# EAGLE design untitled (EAGLE 9.6.2)
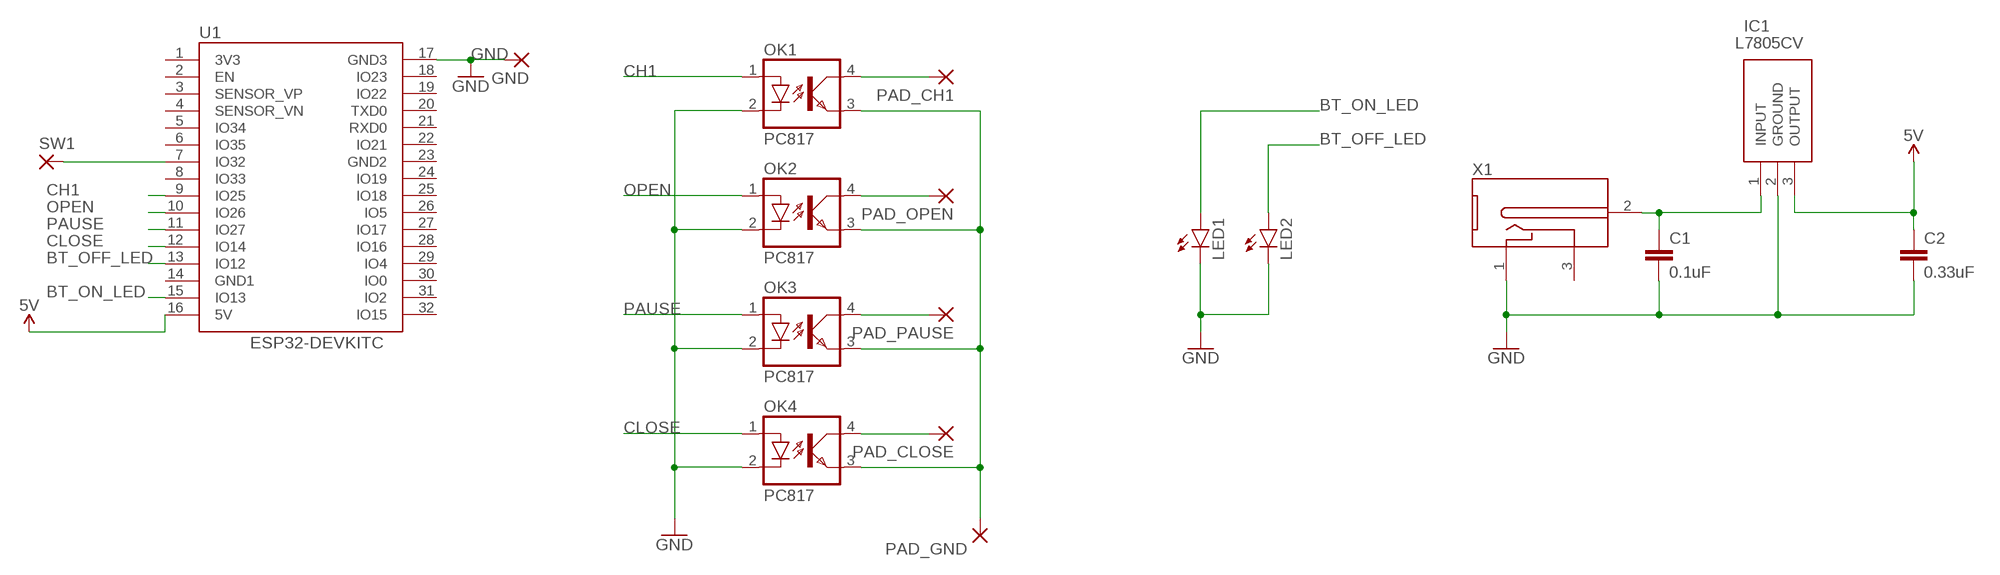
[diagram p0: schematic, sheet 1]

## Parts
C1  0.1uF  C2.5/2  [C2.5-2]
C2  0.33uF  C2.5/2  [C2.5-2]
GND  2,54/1,0  [2,54/1,0]
IC1  L7805CV  [TO255P460X1020X2008-3P]
LED1  LED5MM  [LED5MM]
LED2  LED5MM  [LED5MM]
OK1  PC817  [DIL04]
OK2  PC817  [DIL04]
OK3  PC817  [DIL04]
OK4  PC817  [DIL04]
PAD_CH1  2,54/1,0  [2,54/1,0]
PAD_CLOSE  2,54/1,0  [2,54/1,0]
PAD_GND  2,54/1,0  [2,54/1,0]
PAD_OPEN  2,54/1,0  [2,54/1,0]
PAD_PAUSE  2,54/1,0  [2,54/1,0]
SW1  2,54/1,0  [2,54/1,0]
U1  ESP32-DEVKITC  [MODULE_ESP32-DEVKITC]
X1  DC-2.1MM-5MM  [DC-21MM]

## Nets
5V: C2.1 IC1.3(OUTPUT) U1.16(5V)
BT_OFF_LED: LED2.A U1.13(IO12)
BT_ON_LED: LED1.A U1.15(IO13)
CH1: OK1.1(A) U1.9(IO25)
CLOSE: OK4.1(A) U1.12(IO14)
GND: C1.2 C2.2 GND.1(P) IC1.2(GROUND) LED1.K(C) LED2.K(C) OK1.2(C) OK2.2(C) OK3.2(C) OK4.2(C) U1.17(GND3) X1.1
N$1: OK1.3(EMIT) OK2.3(EMIT) OK3.3(EMIT) OK4.3(EMIT) PAD_GND.1(P)
N$2: OK2.4(COL) PAD_OPEN.1(P)
N$3: OK1.4(COL) PAD_CH1.1(P)
N$4: OK3.4(COL) PAD_PAUSE.1(P)
N$5: OK4.4(COL) PAD_CLOSE.1(P)
N$6: SW1.1(P) U1.7(IO32)
N$8: C1.1 IC1.1(INPUT) X1.2
OPEN: OK2.1(A) U1.10(IO26)
PAUSE: OK3.1(A) U1.11(IO27)
Unconnected: U1.2(EN) U1.3(SENSOR_VP) U1.4(SENSOR_VN) U1.5(IO34) U1.6(IO35) U1.8(IO33) U1.18(IO23) U1.19(IO22) U1.20(TXD0) U1.21(RXD0) U1.22(IO21) U1.24(IO19) U1.25(IO18) U1.26(IO5) U1.27(IO17) U1.28(IO16) U1.29(IO4) U1.30(IO0) U1.31(IO2) U1.32(IO15)

## Power pins joined to a net without a drawn wire
2: X1.3
3V3: U1.1(3V3)
GND1: U1.14(GND1)
GND2: U1.23(GND2)

## Library data of the parts
C1 C2 = capacitor-wima:C: CAPACITOR naming: grid - package width
GND PAD_CH1 PAD_CLOSE PAD_GND PAD_OPEN PAD_PAUSE SW1 = wirepad:2,54/1,0: THROUGH-HOLE PAD
IC1 = L7805CV:L7805CV: Linear voltage regulator,L7805CV 5V 1.5A STMicroelectronics L7805CV, Single Linear Voltage Regulator, 1.5A 5 V, 3-Pin TO-220 Source: Datasheet <http://www.st.com/web/en/resource/technical/document/datasheet/CD00000444.pdf>; ARROW_PART_NUMBER: L7805CV; ARROW_PRICE-STOCK: https://www.arrow.com/en/products/l7805cv/stmicroelectronics?region=europe; DESCRIPTION: Linear voltage regulator,L7805CV 5V 1.5A STMicroelectronics L7805CV, Single Linear Voltage Regulator, 1.5A 5 V, 3-Pin TO-220; HEIGHT: 4.6mm; MANUFACTURER_NAME: STMicroelectronics; MANUFACTURER_PART_NUMBER: L7805CV; MOUSER_PART_NUMBER: 511-L7805CV; MOUSER_PRICE-STOCK: https://www.mouser.co.uk/ProductDetail/STMicroelectronics/L7805CV?qs=9NrABl3fj%2FqplZAHiYUxWg%3D%3D
LED1 LED2 = led:LED: LED OSRAM: - CHIPLED LG R971, LG N971, LY N971, LG Q971, LY Q971, LO R971, LY R971 LH N974, LH R974 LS Q976, LO Q976, LY Q976 LO Q996 - Hyper CHIPLED LW Q18S LB Q993, LB Q99A, LB R99A - SideLED LS A670, LO A670, LY A670, LG A670, LP A670 LB A673, LV A673, LT A673, LW A673 LH A674 LY A675 LS A676, LA A676, LO A676, LY A676, LW A676 LS A679, LY A679, LG A679 - Hyper Micro SIDELED® LS Y876, LA Y876, LO Y876, LY Y876 LT Y87S - SmartLED LW L88C, LW L88S LB L89C, LB L89S, LG L890 LS L89K, LO L89K, LY L89K LS L896, LA L896, LO L896, LY L896 - TOPLED LS T670, LO T670, LY T670, LG T670, LP T670 LSG T670, LSP T670, LSY T670, LOP T670, LYG T670 LG T671, LOG T671, LSG T671 LB T673, LV T673, LT T673, LW T673 LH T674 LS T676, LA T676, LO T676, LY T676, LB T676, LH T676, LSB T676, LW T676 LB T67C, LV T67C, LT T67C, LS T67K, LO T67K, LY T67K, LW E67C LS E67B, LA E67B, LO E67B, LY E67B, LB E67C, LV E67C, LT E67C LW T67C LS T679, LY T679, LG T679 LS T770, LO T770, LY T770, LG T770, LP T770 LB T773, LV T773, LT T773, LW T773 LH T774 LS E675, LA E675, LY E675, LS T675 LS T776, LA T776, LO T776, LY T776, LB T776 LHGB T686 LT T68C, LB T68C - Hyper Mini TOPLED® LB M676 - Mini TOPLED Santana® LG M470 LS M47K, LO M47K, LY M47K Source: http://www.osram.convergy.de LUXEON: - LUMILED® LXK2-PW12-R00, LXK2-PW12-S00, LXK2-PW14-U00, LXK2-PW14-V00 LXK2-PM12-R00, LXK2-PM12-S00, LXK2-PM14-U00 LXK2-PE12-Q00, LXK2-PE12-R00, LXK2-PE12-S00, LXK2-PE14-T00, LXK2-PE14-U00 LXK2-PB12-K00, LXK2-PB12-L00, LXK2-PB12-M00, LXK2-PB14-N00, LXK2-PB14-P00, LXK2-PB14-Q00 LXK2-PR12-L00, LXK2-PR12-M00, LXK2-PR14-Q00, LXK2-PR14-R00 LXK2-PD12-Q00, LXK2-PD12-R00, LXK2-PD12-S00 LXK2-PH12-R00, LXK2-PH12-S00 LXK2-PL12-P00, LXK2-PL12-Q00, LXK2-PL12-R00 Source: www.luxeon.com KINGBRIGHT: KA-3528ASYC Source: www.kingbright.com
OK1-OK4 = optocoupler:PC817: SHARP OPTO COUPLER; MPN: PC817X4J000F; OC_FARNELL: 9707727; OC_NEWARK: 97K7059
U1 = AE-ESP32-WROOM-32E-MINI:ESP32-DEVKITC: ESP32-DEVKITC Check availability <https://pricing.snapeda.com/parts/ESP32-DEVKITC/Espressif%20Systems/view-part?ref=eda>; AVAILABILITY: In Stock; DESCRIPTION: ESP32-WROOM-32UE series Transceiver; 802.11 b/g/n (Wi-Fi, WiFi, WLAN), Bluetooth ® Smart Ready 4.x Dual Mode Evaluation Board; MF: Espressif Systems; MP: ESP32-DEVKITC; PACKAGE: None; PRICE: None; PURCHASE-URL: https://pricing.snapeda.com/search/part/ESP32-DEVKITC/?ref=eda
X1 = power-jack:DC: 5mm x 2.1mm jack

## Board
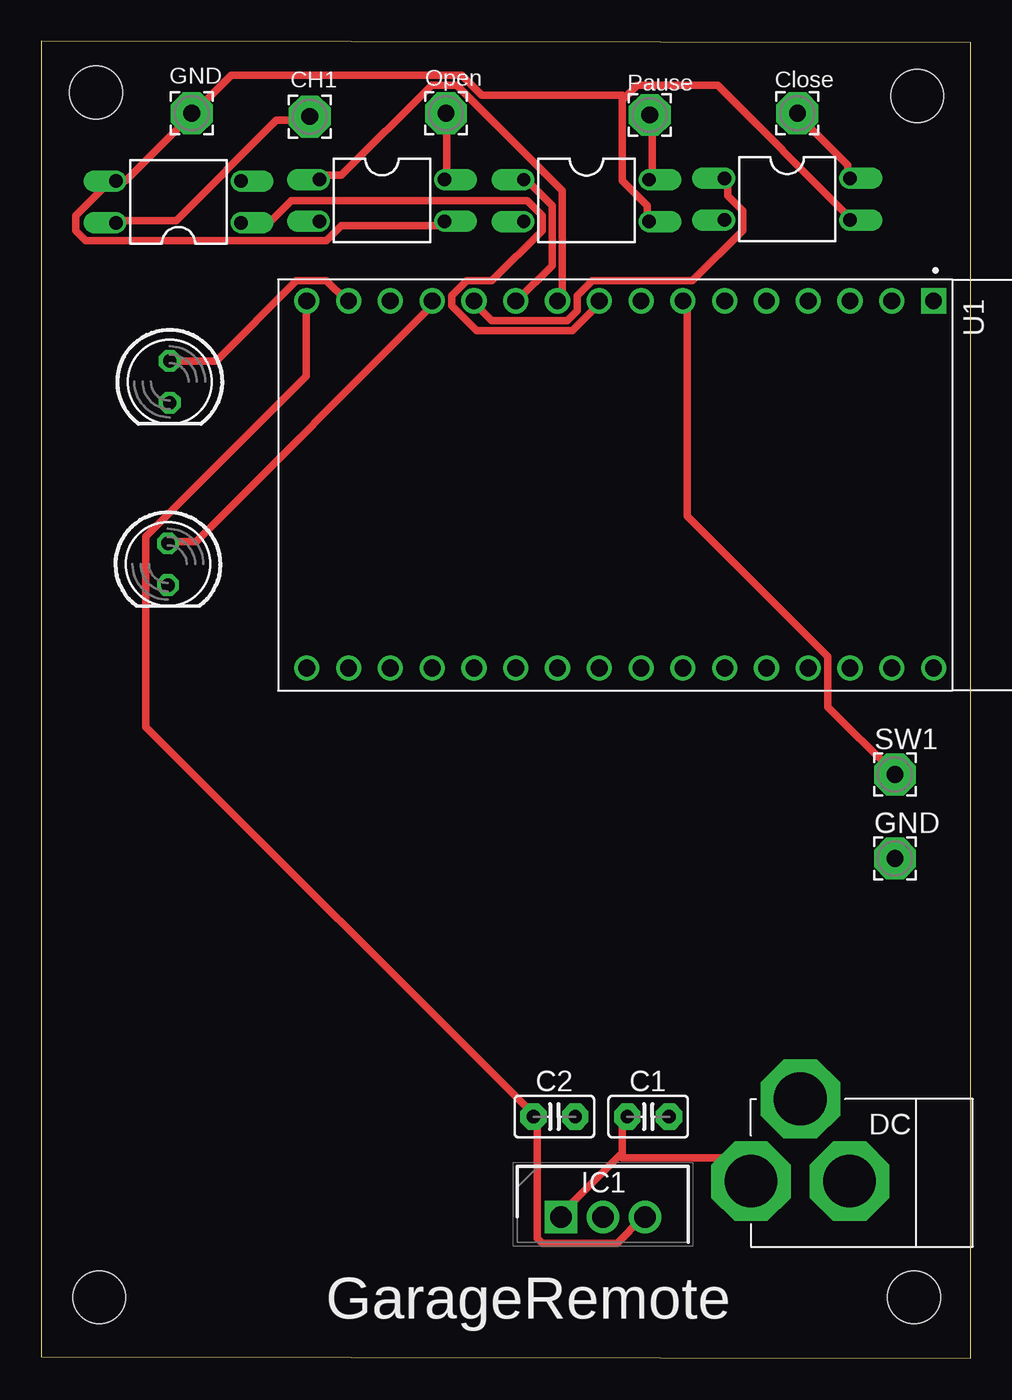
[diagram p1: board, top side]
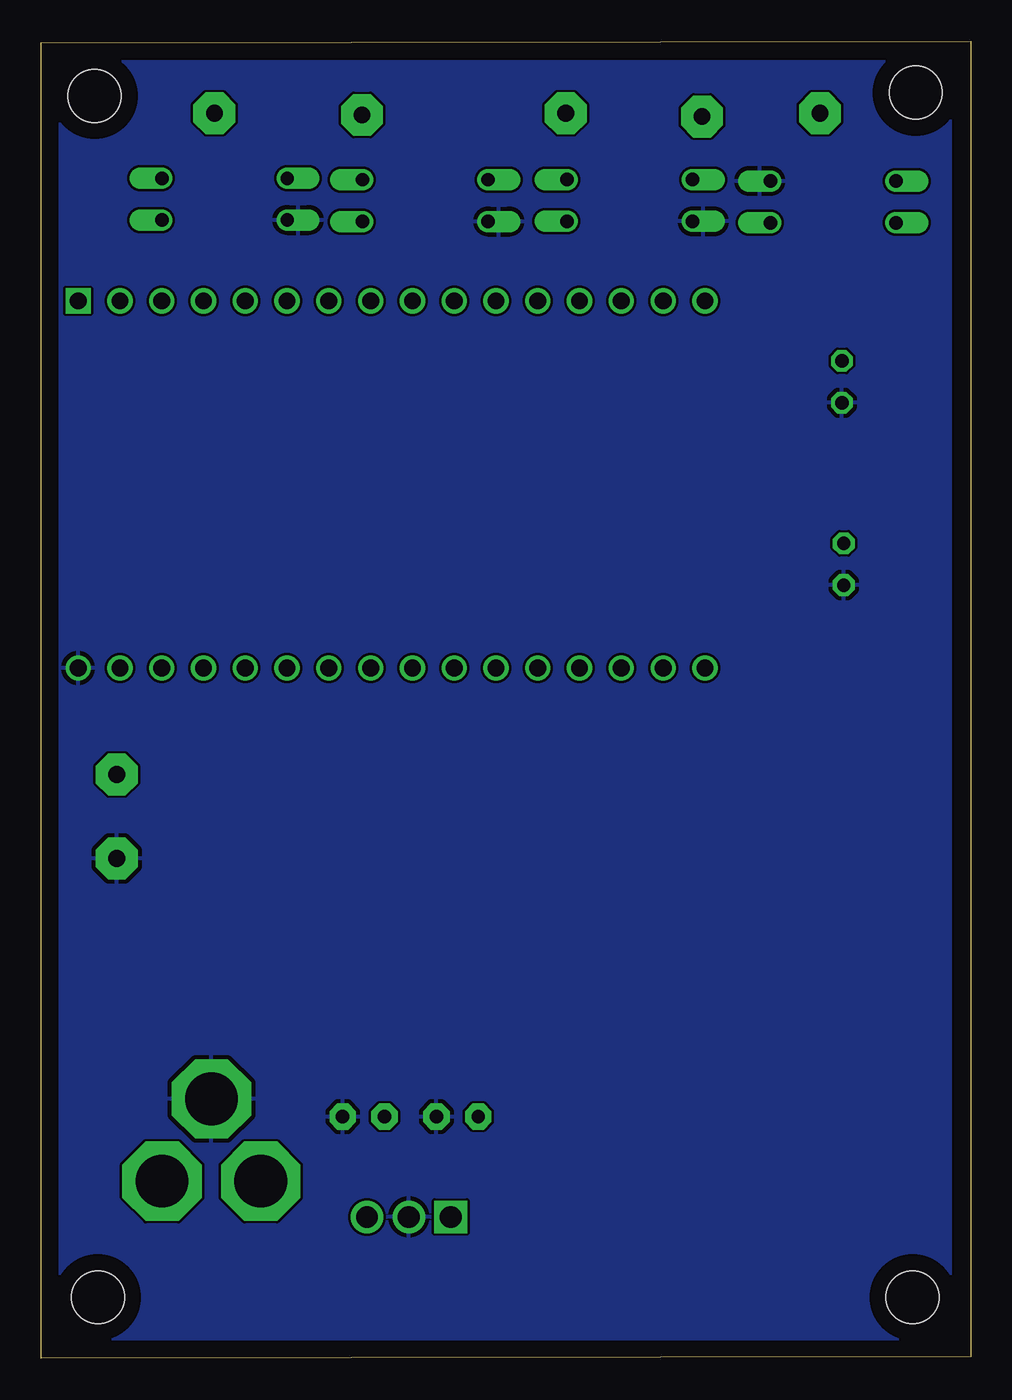
[diagram p2: board, bottom side, seen from below]

Size 56.5 x 80.1 mm. Coordinates in mm from the lower left corner, seen from the top.
Outline: 56.5,80 0,80.1 0,0.1 56.5,0 56.5,80
Copper layers (1*16): Top 0.035mm / dielectric 1.5mm / Bottom 0.035mm
Design rules "default *": minimum track width 18mil, minimum drill 0.35mm, track to track 6mil, track to pad 6mil, pad to pad 6mil, via to via 6mil, smd to smd 6mil, copper to edge 40mil, drill to drill 6mil, minimum pad ring 10mil, minimum via ring 8mil, stop-mask expansion 4mil, vias tented up to drill 0mil, thermal gap 10mil
Holes 3.2 mm at 3.33,76.97 53.25,76.77 3.53,3.71 53.05,3.71

### Footprints (pad centres in the part's own frame; a part is rotated, then mirrored left to right if it is on the bottom)
C2.5-2 = drill 0.813 pad 1.6 octagon: 1 -1.27,0; 2 1.27,0
2,54/1,0 = drill 1.016 pad 2.54 octagon: 1 0,0
TO255P460X1020X2008-3P = drill 1.32 pad 1.98 square: 1 0,0 | drill 1.32 pad 1.98: 2 2.55,0; 3 5.1,0
LED5MM = drill 0.813 octagon: A -1.27,0; K 1.27,0
DIL04 = drill 0.813 offset: 1 -1.27,-3.81; 2 1.27,-3.81; 3 1.27,3.81; 4 -1.27,3.81
MODULE_ESP32-DEVKITC = drill 1.02 square: 1 -12.7,22.85 | drill 1.02: 2 -12.7,20.31; 3 -12.7,17.77; 4 -12.7,15.23; 5 -12.7,12.69; 6 -12.7,10.15; 7 -12.7,7.61; 8 -12.7,5.07; 9 -12.7,2.53; 10 -12.7,-0.01; 11 -12.7,-2.55; 12 -12.7,-5.09; 13 -12.7,-7.63; 14 -12.7,-10.17; 15 -12.7,-12.71; 16 -12.7,-15.25; 17 9.62,22.85; 18 9.62,20.31; 19 9.62,17.77; 20 9.62,15.23; 21 9.62,12.69; 22 9.62,10.15; 23 9.62,7.61; 24 9.62,5.07; 25 9.62,2.53; 26 9.62,-0.01; 27 9.62,-2.55; 28 9.62,-5.09; 29 9.62,-7.63; 30 9.62,-10.17; 31 9.62,-12.71; 32 9.62,-15.25
DC-21MM = drill 3.2 pad 4.826 octagon: 1 -5.08,-3.353; 2 -0.076,-6.35; 3 -0.076,-0.356

### Placement (x,y rotation side)
C1  36.9,14.7 0 top
C2  31.2,14.7 0 top
GND  51.9,30.4 0 top
IC1  31.6,8.6 0 top
LED1  7.82,59.38 270 top
LED2  7.71,48.29 270 top
OK1  8.35,70.32 90 top
OK2  20.72,70.41 270 top
OK3  33.15,70.4 270 top
OK4  45.35,70.49 270 top
PAD_CH1  16.33,75.51 0 top
PAD_CLOSE  45.97,75.71 0 top
PAD_GND  9.15,75.71 0 top
PAD_OPEN  24.61,75.71 0 top
PAD_PAUSE  36.99,75.61 0 top
SW1  51.9,35.5 0 top
U1  31.4,51.6 270 top
X1  49.5,10.7 270 top

### Tracks (layer width: path | path; a pad name or v marks a point on that pad's centre or on a via)
5V
  Top 0.457: U1.16 16.12,64.01 16.12,59.74 6.37,49.99 6.37,38.41 29.84,14.94 C2.1 30.15,14.63 30.15,7.32 30.45,7.01 35.02,7.01 36.55,8.53 IC1.3
BT_OFF_LED
  Top 0.457: LED2.A 7.89,49.68 9.42,49.68 23.74,64.01 U1.13
BT_ON_LED
  Top 0.457: LED1.A 7.89,60.66 10.64,60.66 15.51,65.53 17.34,65.53 18.56,64.31 U1.15
CH1
  Top 0.457: OK1.1 12.16,69.19 13.99,69.19 15.21,70.41 29.53,70.41 30.45,69.49 30.45,68.58 27.4,65.53 25.88,65.53 24.96,64.62 24.96,64.01 26.49,62.48 32.28,62.48 33.8,64.01 U1.9
CLOSE
  Top 0.457: OK4.1 41.73,71.63 41.73,70.71 42.64,69.8 42.64,68.58 39.59,65.53 33.5,65.53 32.58,64.62 32.58,63.7 31.97,63.09 27.4,63.09 26.49,64.01 U1.12
GND
  pour Bottom: 1.21,78.89 55.47,78.89 55.47,1.16 1.21,1.16
N$1
  Top 0.457: 35.48,76.66 36.24,77.42 41.12,77.42 49.04,69.49 OK4.3 | 35.48,76.66 35.33,76.5 35.33,71.63 36.85,70.1 36.85,69.19 OK3.3 | OK2.3 24.35,68.89 18.26,68.89 17.34,67.97 2.71,67.97 2.1,68.58 2.1,69.49 4.24,71.63 OK1.3 4.54,71.63 5.15,71.63 9.11,75.59 PAD_GND.1 9.42,75.89 11.55,78.03 25.57,78.03 26.79,76.81 35.33,76.81 35.48,76.66
N$2
  Top 0.457: OK2.4 24.66,71.93 24.66,75.59 PAD_OPEN.1
N$3
  Top 0.457: OK1.4 4.54,69.19 8.2,69.19 14.3,75.29 16.12,75.29 PAD_CH1.1
N$4
  Top 0.457: OK3.4 37.16,71.93 37.16,75.59 PAD_PAUSE.1
N$5
  Top 0.457: OK4.4 49.04,71.93 49.04,72.54 45.99,75.59 PAD_CLOSE.1
N$6
  Top 0.457: U1.7 39.29,64.01 39.29,51.21 47.82,42.67 47.82,39.62 51.79,35.66 SW1.1
N$8
  Top 0.457: 35.17,12.34 31.67,8.84 IC1.1 | 35.17,12.34 35.33,12.5 35.33,14.63 C1.1 | 35.17,12.34 35.33,12.19 41.73,12.19 42.95,10.97 X1.2
OPEN
  Top 0.457: OK2.1 17.04,71.93 18.26,71.93 23.74,77.42 25.27,77.42 31.67,71.02 31.67,64.31 U1.10
PAUSE
  Top 0.457: OK3.1 29.53,71.63 31.06,70.1 31.06,66.45 28.93,64.31 U1.11

### Text on the board
tNames: GND | CH1 | Open | Pause | Close | DC | GND | GarageRemote